# EAGLE schematic Circuit V3 (EAGLE 7.3.0)
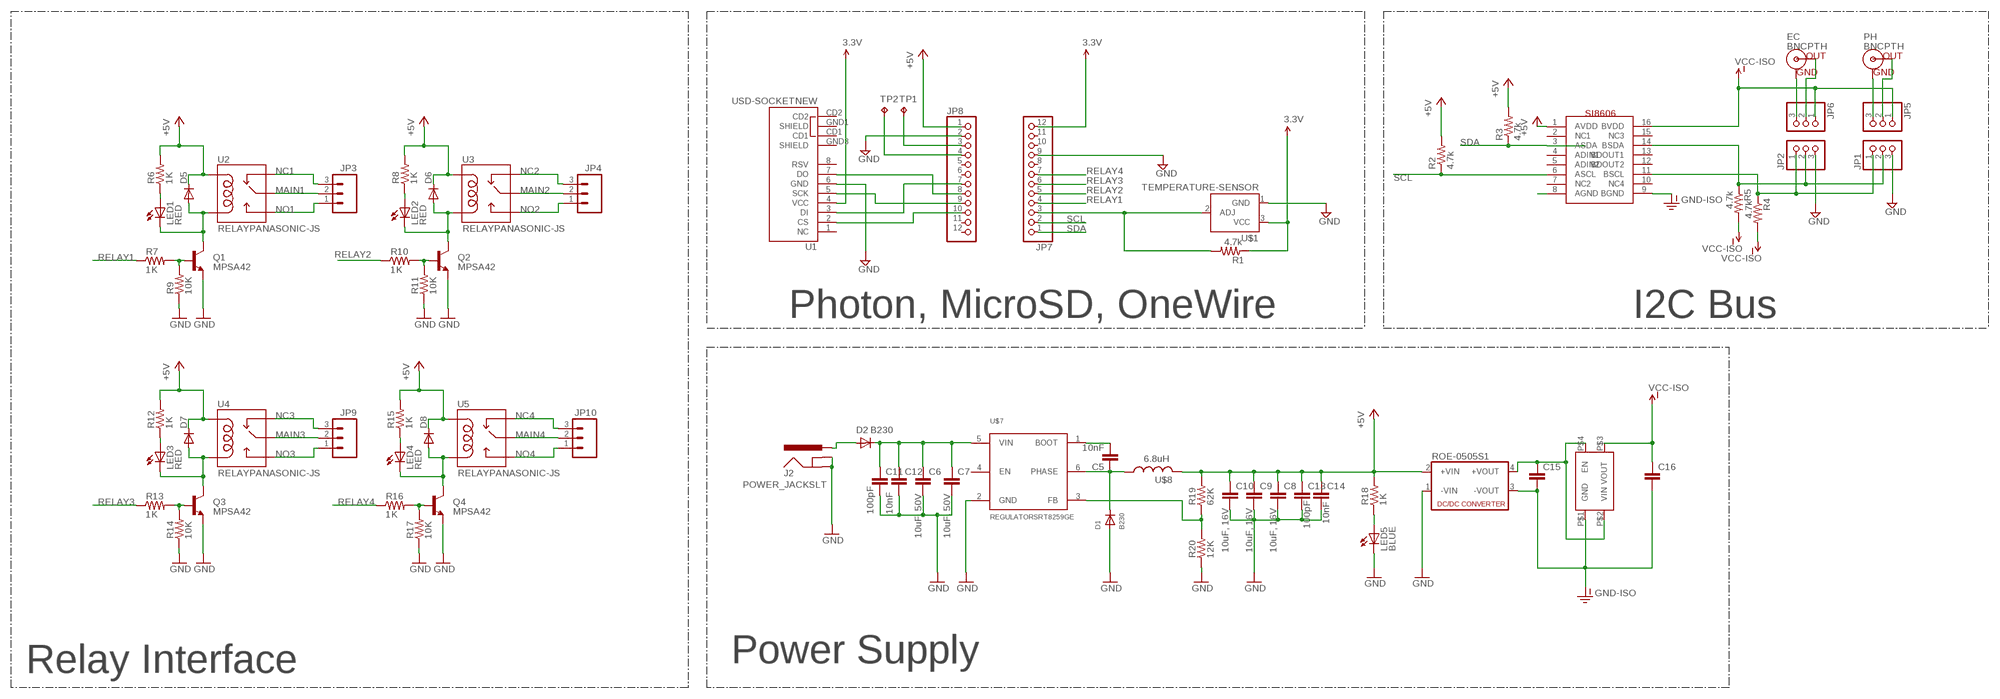
[diagram p0: schematic, sheet 1]

## Parts
C5  10nF  CAP0603-CAP  [0603-CAP]
C6  10uF, 50V  CAP1206  [1206]
C7  10uF, 50V  CAP1206  [1206]
C8  10uF, 16V  CAP1206  [1206]
C9  10uF, 16V  CAP1206  [1206]
C10  10uF, 16V  CAP1206  [1206]
C11  100pF  C-EUC0603  [C0603]
C12  10nF  C-EUC0603  [C0603]
C13  100pF  C-EUC0603  [C0603]
C14  10nF  C-EUC0603  [C0603]
C15  C-EU025-025X050  [C025-025X050]
C16  C-EU025-025X050  [C025-025X050]
D1  B230  DIODESMA  [SMADIODE]
D2  B230  DIODESMA  [SMADIODE]
D5  DIODE-SOD123  [SOD123]
D6  DIODE-SOD123  [SOD123]
D7  DIODE-SOD123  [SOD123]
D8  DIODE-SOD123  [SOD123]
EC  BNCPTH  [BNC]
J2  POWER_JACKSLT  [POWER_JACK_SLOT]
JP1  PINHD-1X3  [1X03]
JP2  PINHD-1X3  [1X03]
JP3  M03-SCREW-5MM  [SCREWTERMINAL-5MM-3]
JP4  M03-SCREW-5MM  [SCREWTERMINAL-5MM-3]
JP5  PINHD-1X3  [1X03]
JP6  PINHD-1X3  [1X03]
JP7  PINHD-1X12  [1X12]
JP8  PINHD-1X12  [1X12]
JP9  M03-SCREW-5MM  [SCREWTERMINAL-5MM-3]
JP10  M03-SCREW-5MM  [SCREWTERMINAL-5MM-3]
LED1  RED  LED0603  [LED-0603]
LED2  RED  LED0603  [LED-0603]
LED3  RED  LED0603  [LED-0603]
LED4  RED  LED0603  [LED-0603]
LED5  BLUE  LED0603  [LED-0603]
PH  BNCPTH  [BNC]
Q1  MPSA42  TRANSISTOR_NPNMPSA42  [SOT23]
Q2  MPSA42  TRANSISTOR_NPNMPSA42  [SOT23]
Q3  MPSA42  TRANSISTOR_NPNMPSA42  [SOT23]
Q4  MPSA42  TRANSISTOR_NPNMPSA42  [SOT23]
R1  4.7k  RESISTORPTH-1/4W  [AXIAL-0.4]
R2  4.7k  RESISTORPTH-1/4W  [AXIAL-0.4]
R3  4.7k  RESISTORPTH-1/4W  [AXIAL-0.4]
R4  4.7k  RESISTORPTH-1/4W  [AXIAL-0.4]
R5  4.7k  RESISTORPTH-1/4W  [AXIAL-0.4]
R6  1K  RESISTOR0603-RES  [0603-RES]
R7  1K  RESISTOR0603-RES  [0603-RES]
R8  1K  RESISTOR0603-RES  [0603-RES]
R9  10K  RESISTOR0603-RES  [0603-RES]
R10  1K  RESISTOR0603-RES  [0603-RES]
R11  10K  RESISTOR0603-RES  [0603-RES]
R12  1K  RESISTOR0603-RES  [0603-RES]
R13  1K  RESISTOR0603-RES  [0603-RES]
R14  10K  RESISTOR0603-RES  [0603-RES]
R15  1K  RESISTOR0603-RES  [0603-RES]
R16  1K  RESISTOR0603-RES  [0603-RES]
R17  10K  RESISTOR0603-RES  [0603-RES]
R18  1K  RESISTOR0603-RES  [0603-RES]
R19  62K  RESISTOR0603-RES  [0603-RES]
R20  12K  RESISTOR0603-RES  [0603-RES]
ROE-0505S1  NME  [NME]
SI1  SI8606AC  [SI8606]
TP1  TPB2,54  [B2,54]
TP2  TPB2,54  [B2,54]
U1  USD-SOCKETNEW  [MICRO-SD-SOCKET-PP]
U2  RELAYPANASONIC-JS  [JS1-5V-F]
U3  RELAYPANASONIC-JS  [JS1-5V-F]
U4  RELAYPANASONIC-JS  [JS1-5V-F]
U5  RELAYPANASONIC-JS  [JS1-5V-F]
U$1  TEMPERATURE-SENSOR  [TO-92]
U$4  NCP698  [SC82-AB]
U$7  REGULATORSRT8259GE  [SOT23-6]
U$8  INDUCTORS  [NR8040T6R8N]

## Nets
3.3V: JP7.12 R1.P$1 U1.4(VCC) U$1.3(VCC)
+5V: C8.1 C9.1 C10.1 C13.1 C14.1 D5.C D6.C D7.C D8.C JP8.1 R2.P$2 R3.P$2 R6.2 R8.2 R12.2 R15.2 R18.2 R19.2 ROE-0505S1.2(+VIN) SI1.1(AVDD) U2.COIL1 U3.COIL1 U4.COIL1 U5.COIL1 U$8.P$2
GND: C6.2 C7.2 C8.2 C9.2 C10.2 C11.2 C12.2 C13.2 C14.2 D1.A J2.GND@1(GNDBREAK) J2.GND@2(GND) JP1.3 JP2.3 JP7.9 JP8.2 LED5.C Q1.2(E) Q2.2(E) Q3.2(E) Q4.2(E) R9.1 R11.1 R14.1 R17.1 R20.1 ROE-0505S1.1(-VIN) U1.6(GND) U$1.1(GND) U$7.2(GND)
GND-ISO: C15.2 C16.2 ROE-0505S1.3(-VOUT) SI1.9(BGND)
MAIN1: JP3.2 U2.COMMON(MAIN)
MAIN2: JP4.2 U3.COMMON(MAIN)
MAIN3: JP9.2 U4.COMMON(MAIN)
MAIN4: JP10.2 U5.COMMON(MAIN)
N$1: JP8.10 U1.2(CS)
N$2: JP1.2 JP2.2 R5.P$1 SI1.14(BSDA)
N$3: JP8.7 U1.3(DI)
N$4: JP8.8 U1.7(DO)
N$5: JP8.9 U1.5(SCK)
N$6: JP5.3 PH.GND
N$7: EC.GND JP6.3
N$8: JP5.2 PH.S(OUT)
N$9: EC.S(OUT) JP6.2
N$10: R1.P$2 U$1.2(ADJ)
N$11: Q1.1(B) R7.2 R9.2
N$12: JP1.1 JP2.1 R4.P$1 SI1.11(BSCL)
N$13: SI1.8(AGND)
N$14: C15.1 ROE-0505S1.4(+VOUT) U$4.P$2(VIN) U$4.P$4(EN)
N$15: JP8.3 TP1.TP
N$16: D5.A LED1.C Q1.3(C) U2.COIL2
N$17: LED1.A R6.1
N$18: Q2.1(B) R10.2 R11.2
N$19: D6.A LED2.C Q2.3(C) U3.COIL2
N$20: LED2.A R8.1
N$21: Q3.1(B) R13.2 R14.2
N$22: D7.A LED3.C Q3.3(C) U4.COIL2
N$23: LED3.A R12.1
N$24: Q4.1(B) R16.2 R17.2
N$25: D8.A LED4.C Q4.3(C) U5.COIL2
N$26: LED4.A R15.1
N$27: LED5.A R18.1
N$28: JP8.4 TP2.TP
N$42: C6.1 C7.1 C11.1 C12.1 D2.C U$7.5(VIN)
N$43: D2.A J2.PWR
N$47: C5.1 D1.C U$7.6(PHASE) U$8.P$1
N$48: C5.2 U$7.1(BOOT)
N$55: JP7.3
N$144: R19.1 R20.2 U$7.3(FB)
NC1: JP3.3 U2.CLOSED(NC)
NC2: JP4.3 U3.CLOSED(NC)
NC3: JP9.3 U4.CLOSED(NC)
NC4: JP10.3 U5.CLOSED(NC)
NO1: JP3.1 U2.OPEN(NO)
NO2: JP4.1 U3.OPEN(NO)
NO3: JP9.1 U4.OPEN(NO)
NO4: JP10.1 U5.OPEN(NO)
RELAY1: JP7.4 R7.1
RELAY2: JP7.5 R10.1
RELAY3: JP7.6 R13.1
RELAY4: JP7.7 R16.1
SCL: JP7.2 R2.P$1 SI1.6(ASCL)
SDA: JP7.1 R3.P$1 SI1.3(ASDA)
VCC-ISO: C16.1 JP5.1 JP6.1 R4.P$2 R5.P$2 SI1.16(BVDD) U$4.P$3(VOUT)
Unconnected: JP7.8 JP7.10 JP7.11 JP8.5 JP8.6 JP8.11 JP8.12 SI1.2(NC1) SI1.4(ADIN1) SI1.5(ADIN2) SI1.7(NC2) SI1.10(NC4) SI1.12(BDOUT2) SI1.13(BDOUT1) SI1.15(NC3) U1.1(NC) U1.8(RSV) U1.CD1 U1.CD2 U1.GND1(SHIELD) U1.GND3(SHIELD) U$4.P$1(GND) U$7.4(EN)

## Notes on the sheet
- Photon, MicroSD, OneWire | I2C Bus
- 6.8uH
- Relay Interface | Power Supply

## Library data of the parts
C5-C10 = SparkFun-Capacitors:CAP: Capacitor Standard 0603 ceramic capacitor, and 0.1" leaded capacitor.; OC_FARNELL: unknown
C11-C16 = rcl:C-EU: CAPACITOR, European symbol; OC_FARNELL: unknown
D1 D2 = adafruit:DIODE: Diode SMADIODE - SMA Surface Mount Package 20V 1A Schottky Diode Digikey: 641-1014-6-ND DO-1N4148 - Through Hole Small Current Diode SOD-123 20V 1 A (.5mV Vf) Schottky Diode - Digikey: MBRX120TPMSCT-ND SOD-323 10V 570mA (.38mV Vf, 3ns) Schottky Diode - Digikey: ZLLS410CT-ND SOD-523 30V 30mA Schottky Diode (RB751S-40TE61) - Digikey: RB751S-40TE61CT-ND SOT23-R/W - SOT23 Package (R = Solder Paste/Reflow Ovens, W = Hand-Soldering) BAT54Film 40V 300mA - Digikey: 497-7162-1-ND
D5-D8 = diode:DIODE-: DIODE; OC_FARNELL: unknown
EC PH = SparkFun-Connectors:BNC: BNC Connector, Mouser Part# 5227161
J2 = Spark:POWER_JACK: Power Jack This is the standard 5.5mm barrel jack for power. The PTH is the most common, proven, reliable, footprint. The Slot footprint only works if the mill layer is transmitted to the PCB fab house so be warned. Spark Fun Electronics SKU : PRT-00119 SMT: CONN-08106 Mating wall wart : TOL-00298 (and others)
JP1 JP2 JP5 JP6 = pinhead:PINHD-1X3: PIN HEADER; OC_FARNELL: unknown
JP3 JP4 JP9 JP10 = SparkFun-Connectors:M03: Header 3 Standard 3-pin 0.1" header. Use with straight break away headers (SKU : PRT-00116), right angle break away headers (PRT-00553), swiss pins (PRT-00743), machine pins (PRT-00117), and female headers (PRT-00115). Molex polarized connector foot print use with SKU : PRT-08232 with associated crimp pins and housings.; OC_FARNELL: unknown
JP7 JP8 = pinhead:PINHD-1X12: PIN HEADER; OC_FARNELL: unknown
LED1-LED5 = SparkFun-LED:LED: LEDs Standard schematic elements and footprints for 5mm, 3mm, 1206, and 0603 sized LEDs. 5mm - Spark Fun Electronics SKU : COM-00529 (and others)
Q1-Q4 = SparkFun-DiscreteSemi:TRANSISTOR_NPN: Generic NPN BJT MMBT2222A - TRANS-08049 (SOT-23, 1A 40V) MPSA42 - TRANS-09116 (SOT-23, 500mA 300V) MMBT5088LT1G - TRANS-11160 (SOT-23, 50 mA 30V); PROD_ID: TRANS-09116
R1-R5 = SparkFun-Resistors:RESISTOR: Resistor Basic schematic elements and footprints for 0603, 1206, and PTH resistors.
R6-R17 R20 = SparkFun-Passives:RESISTOR: Resistor Basic schematic elements and footprints for 0603, 1206, and PTH resistors.; OC_FARNELL: unknown
R18 R19 = SparkFun-Passives:RESISTOR: Resistor Basic schematic elements and footprints for 0603, 1206, and PTH resistors.
ROE-0505S1 = dc-dc-converter:NME: DC-DC CONVERTER; MF: MURATA POWER SOLUTIONS; MPN: NME1215SC; OC_FARNELL: 1021466; OC_NEWARK: 98B8198
SI1 = MyLib:SI8606AC; OC_FARNELL: unknown
TP1 TP2 = testpad:TP: Test pad
U1 = SparkFun-Connectors:USD-SOCKET: microSD Socket Push-push type uSD socket. Schematic element and footprint production proven. Spark Fun Electronics SKU : PRT-00127. tDoc lines correctly indicate media card edge positions when inserting (unlocked, locked, depressed). NOTE: CD1 and CD2 are connected internally; PROD_ID: CONN-07820
U2-U5 = Spark:RELAY: SPDT relay (COM-00101)
U$1 = SparkFun-Sensors:TEMPERATURE-SENSOR: TO-92 temp sensor
U$4 = ncp698_library:NCP698: ON Semiconductot NCP698 150 mA CMOS Ultra Low Iq and IGND LDO Regulator with Enable Source: NCP698 Datasheet <http://www.onsemi.com/pub_link/Collateral/NCP698-D.PDF> created by: mochini@2015 <http://www.farnell.com/datasheets/1820782.pdf>
U$7 = mohit-eagle:REGULATORS
U$8 = mohit-eagle:INDUCTORS